# EAGLE design XMICRO-BREAKOUT V1.0 (EAGLE 6.3)
PROJECT_NAME: XMICRO-BREAKOUT; PROJECT_REVISION: 1.0
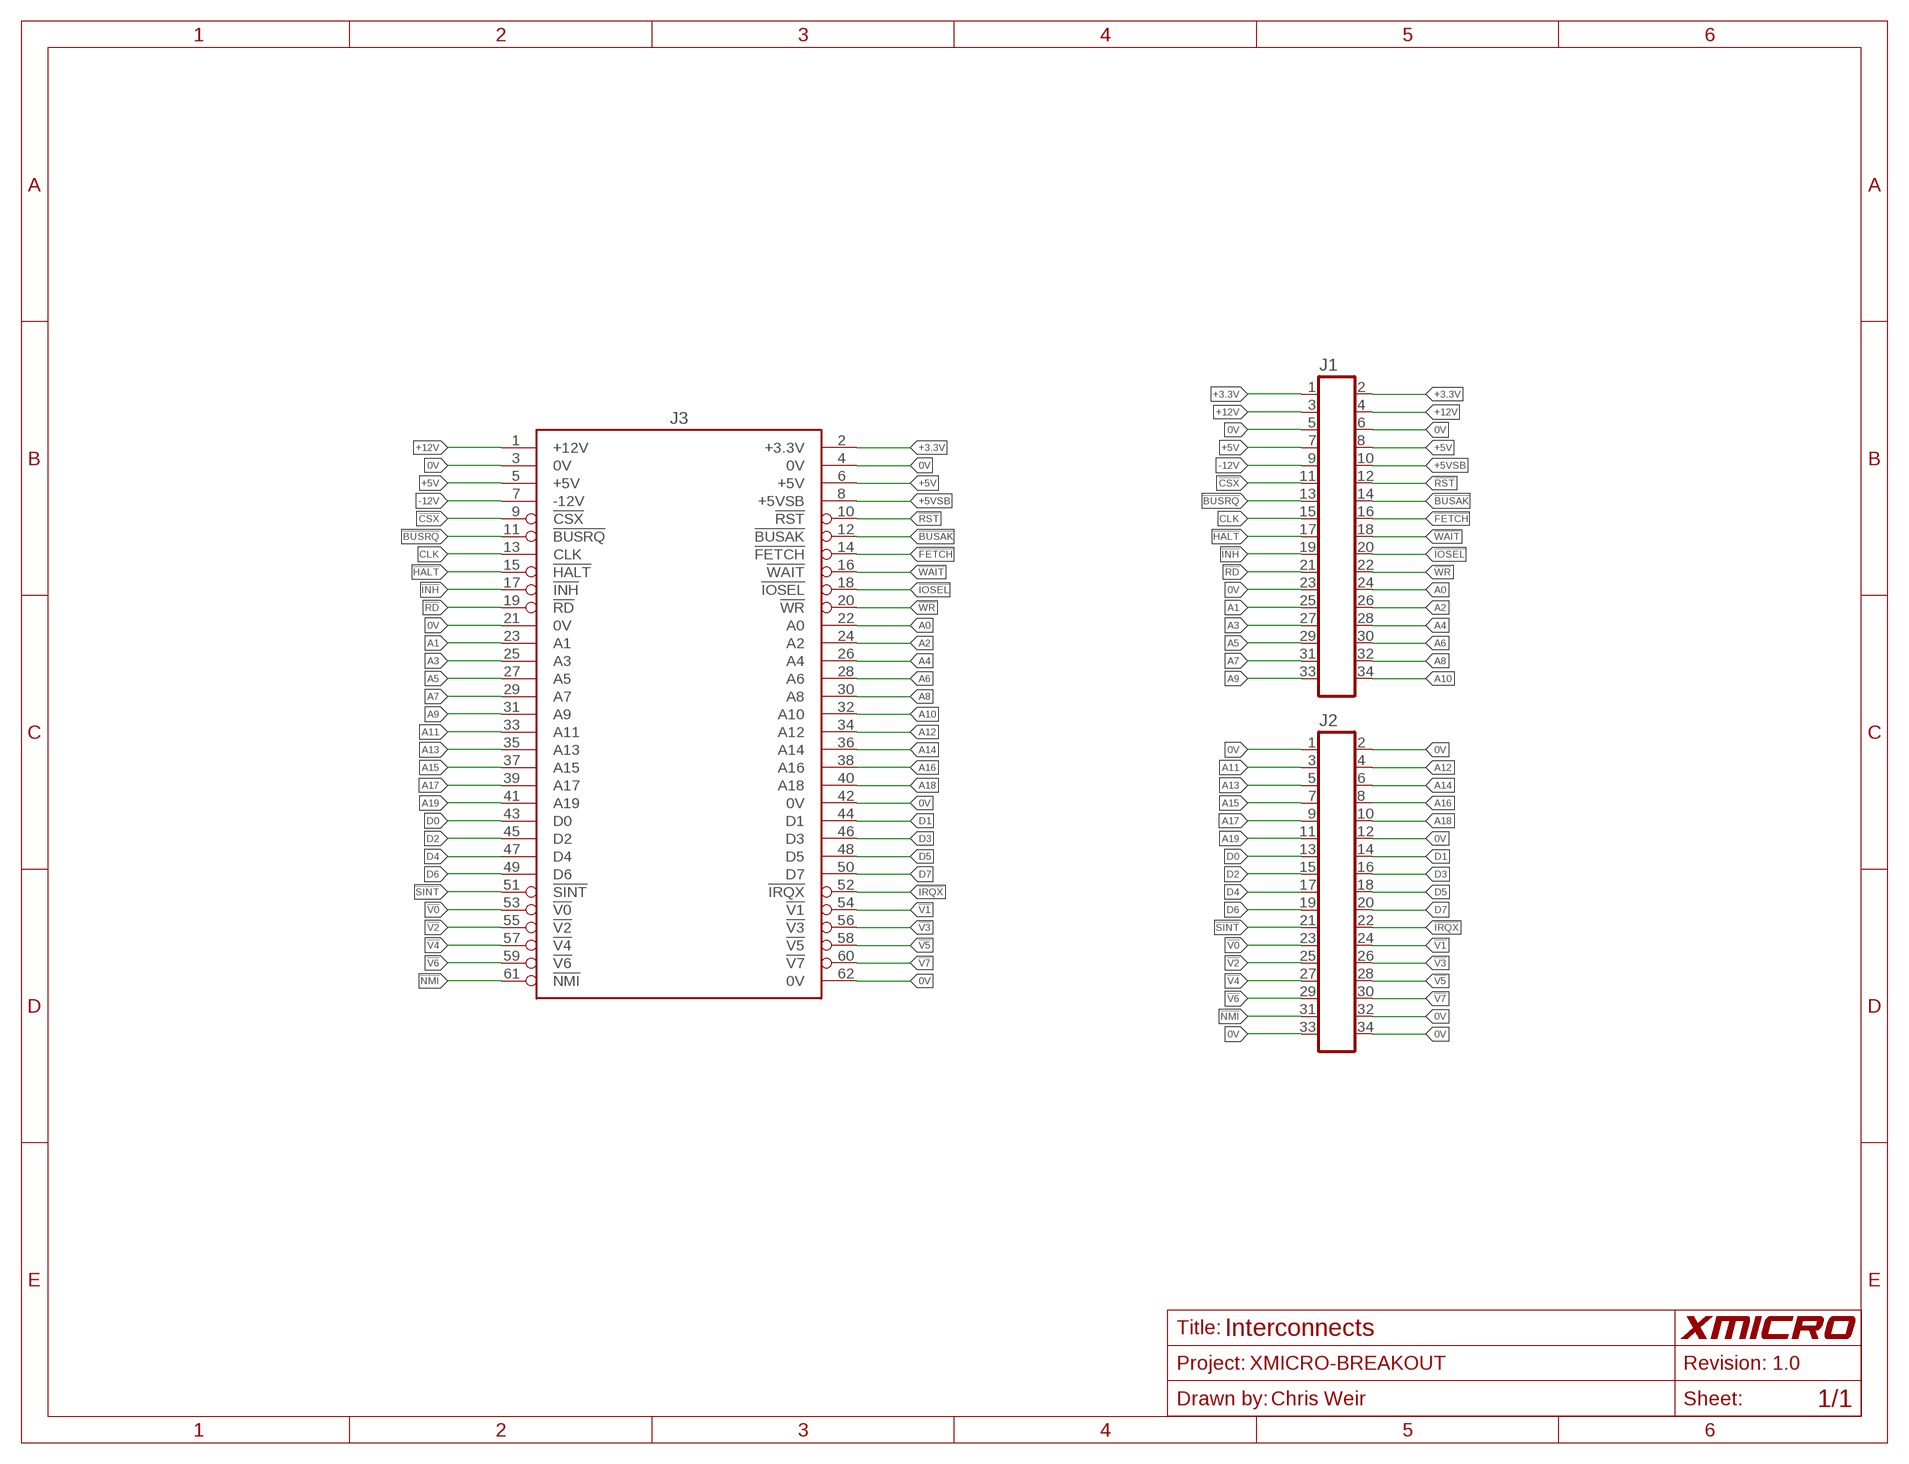
[diagram p0: schematic, sheet 1]
FRAME1 (LETTER): DRAWN_BY: Chris Weir; SHEET_TITLE: Interconnects

## Parts
J1  HDR-17X2  [HDR-17X2S]
J2  HDR-17X2  [HDR-17X2S]
J3  XMICRO-BUS-PHYSICAL-M  [EDGE62M]

## Nets
0V [SUPPLY]: J1.5 J1.6 J1.23 J2.1 J2.2 J2.12 J2.32 J2.33 J2.34 J3.3(0V) J3.4(0V) J3.21(0V) J3.42(0V) J3.62(0V)
!BUSAK: J1.14 J3.12(!BUSAK)
!BUSRQ: J1.13 J3.11(!BUSRQ)
!CSX: J1.11 J3.9(!CSX)
!FETCH: J1.16 J3.14(!FETCH)
!HALT: J1.17 J3.15(!HALT)
!INH: J1.19 J3.17(!INH)
!IOSEL: J1.20 J3.18(!IOSEL)
!IRQX: J2.22 J3.52(!IRQX)
!NMI: J2.31 J3.61(!NMI)
!RD: J1.21 J3.19(!RD)
!RST: J1.12 J3.10(!RST)
!SINT: J2.21 J3.51(!SINT)
!V0: J2.23 J3.53(!V0)
!V1: J2.24 J3.54(!V1)
!V2: J2.25 J3.55(!V2)
!V3: J2.26 J3.56(!V3)
!V4: J2.27 J3.57(!V4)
!V5: J2.28 J3.58(!V5)
!V6: J2.29 J3.59(!V6)
!V7: J2.30 J3.60(!V7)
!WAIT: J1.18 J3.16(!WAIT)
!WR: J1.22 J3.20(!WR)
+3.3V [SUPPLY]: J1.1 J1.2 J3.2(+3.3V)
+5V [SUPPLY]: J1.7 J1.8 J3.5(+5V) J3.6(+5V)
+5VSB [SUPPLY]: J1.10 J3.8(+5VSB)
+12V [SUPPLY]: J1.3 J1.4 J3.1(+12V)
-12V [SUPPLY]: J1.9 J3.7(-12V)
A0: J1.24 J3.22(A0)
A1: J1.25 J3.23(A1)
A2: J1.26 J3.24(A2)
A3: J1.27 J3.25(A3)
A4: J1.28 J3.26(A4)
A5: J1.29 J3.27(A5)
A6: J1.30 J3.28(A6)
A7: J1.31 J3.29(A7)
A8: J1.32 J3.30(A8)
A9: J1.33 J3.31(A9)
A10: J1.34 J3.32(A10)
A11: J2.3 J3.33(A11)
A12: J2.4 J3.34(A12)
A13: J2.5 J3.35(A13)
A14: J2.6 J3.36(A14)
A15: J2.7 J3.37(A15)
A16: J2.8 J3.38(A16)
A17: J2.9 J3.39(A17)
A18: J2.10 J3.40(A18)
A19: J2.11 J3.41(A19)
CLK: J1.15 J3.13(CLK)
D0: J2.13 J3.43(D0)
D1: J2.14 J3.44(D1)
D2: J2.15 J3.45(D2)
D3: J2.16 J3.46(D3)
D4: J2.17 J3.47(D4)
D5: J2.18 J3.48(D5)
D6: J2.19 J3.49(D6)
D7: J2.20 J3.50(D7)

## Library data of the parts
J1 J2 = connector-misc:HDR-17X2
J3 = xmicro:XMICRO-BUS-PHYSICAL: XMICRO Bus Symbol with physical pin arrangement

## Net classes
1 SUPPLY: width 0.254 mm, clearance 0.305 mm
2 CHASSIS: clearance 0.762 mm

## Board
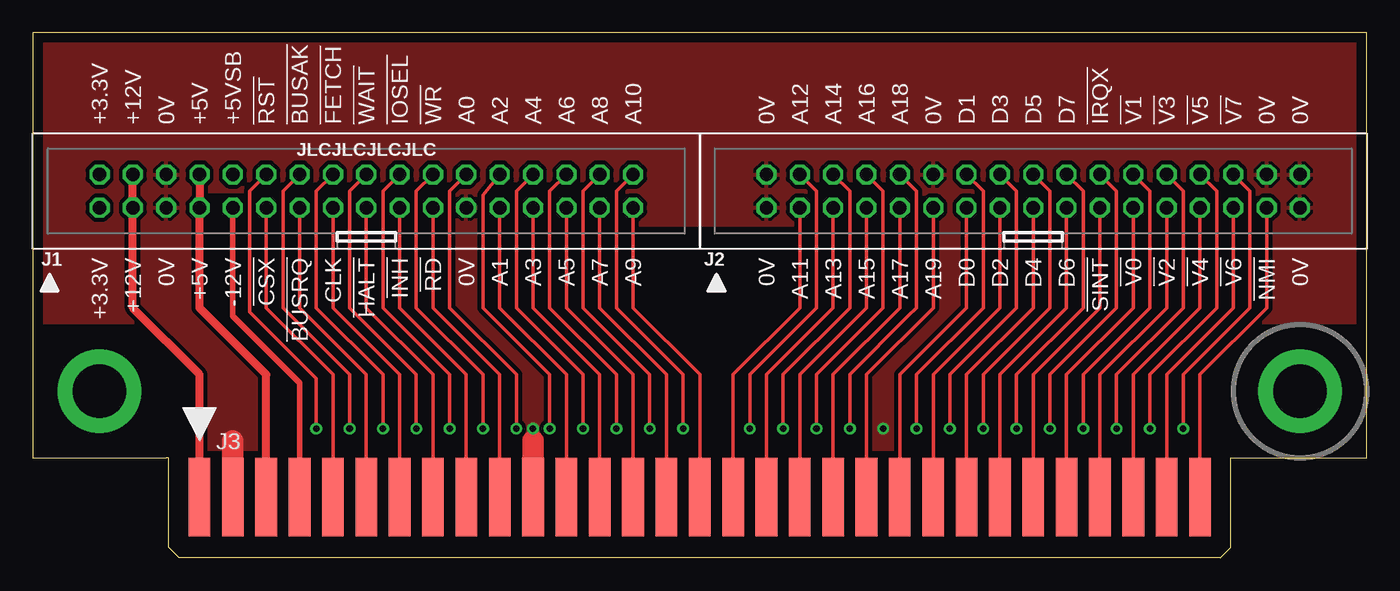
[diagram p1: board, top side]
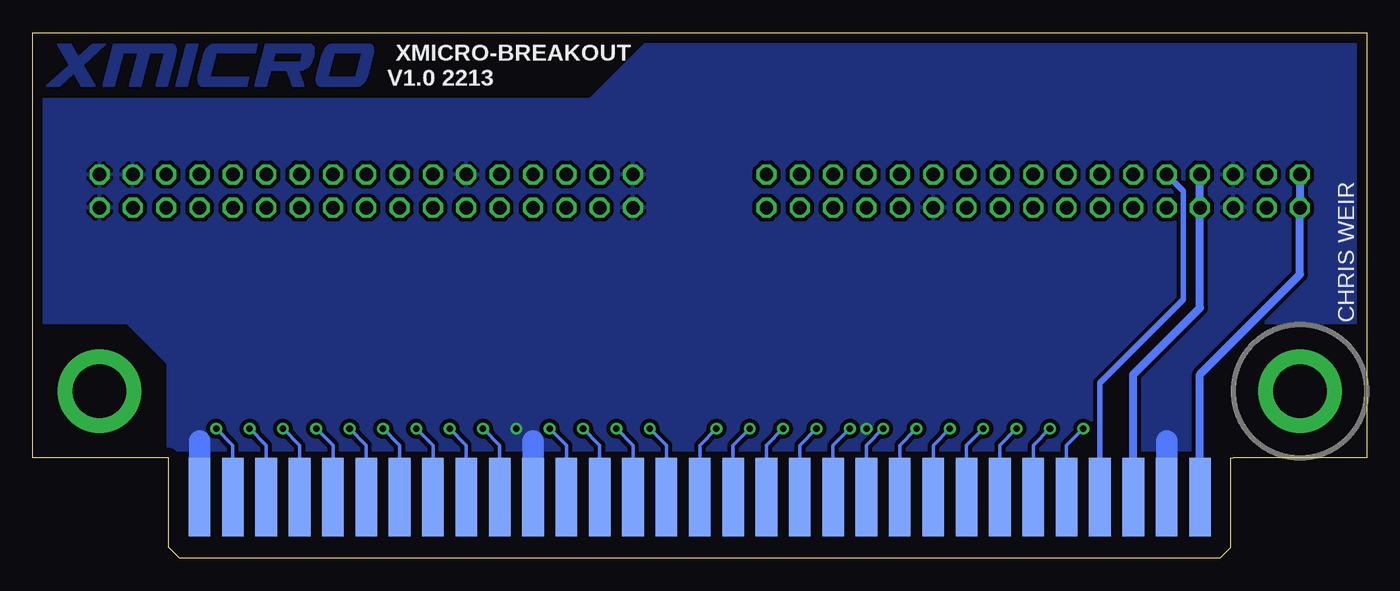
[diagram p2: board, bottom side, seen from below]

Size 101.6 x 40.01 mm. Coordinates in mm from the lower left corner, seen from the top.
Outline: 10.16,7.62 0,7.62 0,40.01 101.6,40.01 101.6,7.62 91.44,7.62
Copper layers (1*16): Top 0.035mm / dielectric 1.5mm / Bottom 0.035mm
Design rules "JLCPCB Standard": minimum track width 5mil, minimum drill 0.3mm, track to track 5mil, track to pad 8mil, pad to pad 8mil, via to via 8mil, smd to smd 5mil, copper to edge 30mil, drill to drill 0.26mm, minimum pad ring 10mil, minimum via ring 8mil, stop-mask expansion 3mil, vias tented up to drill 25mil, thermal gap 10mil
tRestrict: area 91.4,7.6 to 101.6,17.8; area 0,7.6 to 10.2,17.8; 4 lines
bRestrict: area 91.4,7.6 to 101.6,17.8; area 0,7.6 to 10.2,17.8; 4 lines

### Footprints (pad centres in the part's own frame; a part is rotated, then mirrored left to right if it is on the bottom)
HDR-17X2S = drill 1.016 octagon: 1 -20.32,-1.27; 2 -20.32,1.27; 3 -17.78,-1.27; 4 -17.78,1.27; 5 -15.24,-1.27; 6 -15.24,1.27; 7 -12.7,-1.27; 8 -12.7,1.27; 9 -10.16,-1.27; 10 -10.16,1.27; 11 -7.62,-1.27; 12 -7.62,1.27; 13 -5.08,-1.27; 14 -5.08,1.27; 15 -2.54,-1.27; 16 -2.54,1.27; 17 0,-1.27; 18 0,1.27; 19 2.54,-1.27; 20 2.54,1.27; 21 5.08,-1.27; 22 5.08,1.27; 23 7.62,-1.27; 24 7.62,1.27; 25 10.16,-1.27; 26 10.16,1.27; 27 12.7,-1.27; 28 12.7,1.27; 29 15.24,-1.27; 30 15.24,1.27; 31 17.78,-1.27; 32 17.78,1.27; 33 20.32,-1.27; 34 20.32,1.27
EDGE62M = smd 1.651 x 5.969: 1 -38.1,-3.01; 3 -35.56,-3.01; 5 -33.02,-3.01; 7 -30.48,-3.01; 9 -27.94,-3.01; 11 -25.4,-3.01; 13 -22.86,-3.01; 15 -20.32,-3.01; 17 -17.78,-3.01; 19 -15.24,-3.01; 21 -12.7,-3.01; 23 -10.16,-3.01; 25 -7.62,-3.01; 27 -5.08,-3.01; 29 -2.54,-3.01; 31 0,-3.01; 33 2.54,-3.01; 35 5.08,-3.01; 37 7.62,-3.01; 39 10.16,-3.01; 41 12.7,-3.01; 43 15.24,-3.01; 45 17.78,-3.01; 47 20.32,-3.01; 49 22.86,-3.01; 51 25.4,-3.01; 53 27.94,-3.01; 55 30.48,-3.01; 57 33.02,-3.01; 59 35.56,-3.01; 61 38.1,-3.01 | smd 1.651 x 5.969 bottom: 2 -38.1,-3.01; 4 -35.56,-3.01; 6 -33.02,-3.01; 8 -30.48,-3.01; 10 -27.94,-3.01; 12 -25.4,-3.01; 14 -22.86,-3.01; 16 -20.32,-3.01; 18 -17.78,-3.01; 20 -15.24,-3.01; 22 -12.7,-3.01; 24 -10.16,-3.01; 26 -7.62,-3.01; 28 -5.08,-3.01; 30 -2.54,-3.01; 32 0,-3.01; 34 2.54,-3.01; 36 5.08,-3.01; 38 7.62,-3.01; 40 10.16,-3.01; 42 12.7,-3.01; 44 15.24,-3.01; 46 17.78,-3.01; 48 20.32,-3.01; 50 22.86,-3.01; 52 25.4,-3.01; 54 27.94,-3.01; 56 30.48,-3.01; 58 33.02,-3.01; 60 35.56,-3.01; 62 38.1,-3.01

### Placement (x,y rotation side)
J1  25.4,27.94 0 top
J2  76.2,27.94 0 top
J3  50.8,7.62 0 top

### Tracks (layer width: path | path; a pad name or v marks a point on that pad's centre or on a via)
0V  (via drill 0.5)
  Top 1.651: J3.21 38.1,8.89 | J3.3 15.24,8.89
  Bottom 1.651: J3.62 88.9,8.89 | J3.42 63.5,8.89 | J3.3 15.24,8.89
  other vias: 38.1,9.84 64.77,9.84
  pour Top (rank 2): 0,40.01 101.6,40.01 101.6,7.62 91.44,7.62 91.44,8.26 10.16,8.26 10.16,7.62 0,7.62
  pour Bottom (rank 2): 0,40.01 101.6,40.01 101.6,7.62 91.44,7.62 91.44,8.26 10.16,8.26 10.16,7.62 0,7.62
!BUSAK  (via drill 0.5)
  Top 0.254: v24.13,9.84 24.13,13.97 19.05,19.05 19.05,27.94 J1.14
  Bottom 0.254: J3.12 25.4,8.57 v24.13,9.84
!BUSRQ
  Top 0.254: J3.11 25.4,13.97 20.32,19.05 J1.13
!CSX
  Top 0.254: J3.9 22.86,13.97 17.78,19.05 J1.11
!FETCH  (via drill 0.5)
  Top 0.254: v26.67,9.84 26.67,13.97 21.59,19.05 21.59,27.94 J1.16
  Bottom 0.254: J3.14 27.94,8.57 v26.67,9.84
!HALT
  Top 0.254: J3.15 30.48,13.97 25.4,19.05 J1.17
!INH
  Top 0.254: J3.17 33.02,13.97 27.94,19.05 J1.19
!IOSEL  (via drill 0.5)
  Top 0.254: v31.75,9.84 31.75,13.97 26.67,19.05 26.67,27.94 J1.20
  Bottom 0.254: J3.18 33.02,8.57 v31.75,9.84
!IRQX  (via drill 0.5)
  Top 0.254: v77.47,9.84 77.47,13.97 82.55,19.05 82.55,27.94 J2.22
  Bottom 0.254: J3.52 76.2,8.57 v77.47,9.84
!NMI
  Top 0.254: J3.61 88.9,13.97 93.98,19.05 J2.31
!RD
  Top 0.254: J3.19 35.56,13.97 30.48,19.05 J1.21
!RST  (via drill 0.5)
  Top 0.254: v21.59,9.84 21.59,13.65 16.51,18.73 16.51,27.94 J1.12
  Bottom 0.254: J3.10 22.86,8.57 v21.59,9.84
!SINT
  Top 0.254: J3.51 76.2,13.97 81.28,19.05 J2.21
!V0
  Top 0.254: J3.53 78.74,13.97 83.82,19.05 J2.23
!V1  (via drill 0.5)
  Top 0.254: v80.01,9.84 80.01,13.97 85.09,19.05 85.09,27.94 J2.24
  Bottom 0.254: J3.54 78.74,8.57 v80.01,9.84
!V2
  Top 0.254: J3.55 81.28,13.97 86.36,19.05 J2.25
!V3  (via drill 0.5)
  Top 0.254: v82.55,9.84 82.55,13.97 87.63,19.05 87.63,27.94 J2.26
  Bottom 0.254: J3.56 81.28,8.57 v82.55,9.84
!V4
  Top 0.254: J3.57 83.82,13.97 88.9,19.05 J2.27
!V5  (via drill 0.5)
  Top 0.254: v85.09,9.84 85.09,13.97 90.17,19.05 90.17,27.94 J2.28
  Bottom 0.254: J3.58 83.82,8.57 v85.09,9.84
!V6
  Top 0.254: J3.59 86.36,13.97 91.44,19.05 J2.29
!V7  (via drill 0.5)
  Top 0.254: v87.63,9.84 87.63,13.97 92.71,19.05 92.71,27.94 J2.30
  Bottom 0.254: J3.60 86.36,8.57 v87.63,9.84
!WAIT  (via drill 0.5)
  Top 0.254: v29.21,9.84 29.21,13.97 24.13,19.05 24.13,27.94 J1.18
  Bottom 0.254: J3.16 30.48,8.57 v29.21,9.84
!WR  (via drill 0.5)
  Top 0.254: v34.29,9.84 34.29,13.97 29.21,19.05 29.21,27.94 J1.22
  Bottom 0.254: J3.20 35.56,8.57 v34.29,9.84
+3.3V
  Bottom 0.61: J3.2 12.7,13.97 5.08,21.59 J1.1 J1.2
+5V
  Top 0.61: J3.5 17.78,13.97 12.7,19.05 J1.7 J1.8
  Bottom 0.61: J3.5 17.78,13.97 12.7,19.05 J1.7 J1.8
+5VSB
  Bottom 0.406: J3.8 20.32,13.34 13.97,19.68 13.97,27.94 J1.10
+12V
  Top 0.61: J3.1 12.7,13.97 7.62,19.05 J1.3 J1.4
-12V
  Top 0.406: J3.7 20.32,13.34 15.24,18.41 J1.9
A0  (via drill 0.5)
  Top 0.254: v36.83,9.84 36.83,13.97 31.75,19.05 31.75,27.94 J1.24
  Bottom 0.254: J3.22 38.1,8.57 v36.83,9.84
A1
  Top 0.254: J3.23 40.64,13.97 35.56,19.05 J1.25
A2  (via drill 0.5)
  Top 0.254: v39.37,9.84 39.37,13.97 34.29,19.05 34.29,27.62 J1.26
  Bottom 0.254: J3.24 40.64,8.57 v39.37,9.84
A3
  Top 0.254: J3.25 43.18,13.97 38.1,19.05 J1.27
A4  (via drill 0.5)
  Top 0.254: v41.91,9.84 41.91,13.97 36.83,19.05 36.83,27.94 J1.28
  Bottom 0.254: J3.26 43.18,8.57 v41.91,9.84
A5
  Top 0.254: J3.27 45.72,13.97 40.64,19.05 J1.29
A6  (via drill 0.5)
  Top 0.254: v44.45,9.84 44.45,13.97 39.37,19.05 39.37,27.94 J1.30
  Bottom 0.254: J3.28 45.72,8.57 v44.45,9.84
A7
  Top 0.254: J3.29 48.26,13.97 43.18,19.05 J1.31
A8  (via drill 0.5)
  Top 0.254: v46.99,9.84 46.99,13.97 41.91,19.05 41.91,27.94 J1.32
  Bottom 0.254: J3.30 48.26,8.57 v46.99,9.84
A9
  Top 0.254: J3.31 50.8,13.97 45.72,19.05 J1.33
A10  (via drill 0.5)
  Top 0.254: v49.53,9.84 49.53,13.97 44.45,19.05 44.45,27.94 J1.34
  Bottom 0.254: J3.32 50.8,8.57 v49.53,9.84
A11
  Top 0.254: J3.33 53.34,13.97 58.42,19.05 J2.3
A12  (via drill 0.5)
  Top 0.254: v54.61,9.84 54.61,13.97 59.69,19.05 59.69,27.94 J2.4
  Bottom 0.254: J3.34 53.34,8.57 v54.61,9.84
A13
  Top 0.254: J2.5 60.96,19.05 55.88,13.97 J3.35
A14  (via drill 0.5)
  Top 0.254: v57.15,9.84 57.15,13.97 62.23,19.05 62.23,27.94 J2.6
  Bottom 0.254: J3.36 55.88,8.57 v57.15,9.84
A15
  Top 0.254: J3.37 58.42,13.97 63.5,19.05 J2.7
A16  (via drill 0.5)
  Top 0.254: v59.69,9.84 59.69,13.97 64.77,19.05 64.77,27.94 J2.8
  Bottom 0.254: J3.38 58.42,8.57 v59.69,9.84
A17
  Top 0.254: J3.39 60.96,13.97 66.04,19.05 J2.9
A18  (via drill 0.5)
  Top 0.254: v62.23,9.84 62.23,13.97 66.67,18.41 67.31,19.05 67.31,27.94 J2.10
  Bottom 0.254: J3.40 60.96,8.57 v62.23,9.84
A19
  Top 0.254: J3.41 63.5,13.97 68.58,19.05 J2.11
CGND3  (via drill 4.06 pad 6.35)
  other vias: 96.52,12.7
CGND4  (via drill 4.06 pad 6.35)
  other vias: 5.08,12.7
CLK
  Top 0.254: J3.13 27.94,13.97 22.86,19.05 J1.15
D0
  Top 0.254: J3.43 66.04,13.97 71.12,19.05 J2.13
D1  (via drill 0.5)
  Top 0.254: v67.31,9.84 67.31,13.97 72.39,19.05 72.39,27.94 J2.14
  Bottom 0.254: J3.44 66.04,8.57 v67.31,9.84
D2
  Top 0.254: J3.45 68.58,13.97 73.66,19.05 J2.15
D3  (via drill 0.5)
  Top 0.254: v69.85,9.84 69.85,13.97 74.93,19.05 74.93,27.94 J2.16
  Bottom 0.254: J3.46 68.58,8.57 v69.85,9.84
D4
  Top 0.254: J3.47 71.12,13.97 76.2,19.05 J2.17
D5  (via drill 0.5)
  Top 0.254: v72.39,9.84 72.39,13.97 77.47,19.05 77.47,27.94 J2.18
  Bottom 0.254: J3.48 71.12,8.57 v72.39,9.84
D6
  Top 0.254: J3.49 73.66,13.97 78.74,19.05 J2.19
D7  (via drill 0.5)
  Top 0.254: v74.93,9.84 74.93,13.97 80.01,19.05 80.01,27.94 J2.20
  Bottom 0.254: J3.50 73.66,8.57 v74.93,9.84
LOGO-C1
  pour Bottom (no thermals): 84.49,39.18 84.66,38.49 87.65,38.49 88.13,36.61 85.16,36.61 85.32,35.92 88.61,35.92 arc47 88.88,36.04 arc36 89.02,36.35 arc17 89.01,36.62 arc5 88.98,36.77 88.58,38.34 arc33 88.21,38.95 arc31 87.84,39.17 arc13 87.7,39.18
LOGO-I1
  pour Bottom (no thermals): 89.88,39.18 89,39.18 89.84,35.92 90.72,35.92
LOGO-M1
  pour Bottom (no thermals): 96.28,35.92 95.44,39.18 91.15,39.18 arc50 90.82,39.05 arc37 90.69,38.76 arc17 90.72,38.38 91.36,35.92 92.24,35.92 91.56,38.49 92.7,38.49 93.37,35.92 94.26,35.92 93.58,38.49 94.73,38.49 95.39,35.92
LOGO-O1
  pour Bottom (no thermals): 78.61,38.49 76.52,38.49 77.02,36.61 79.14,36.61 78.64,38.49 78.59,39.18 78.7,39.18 arc-33 79.09,39.04 arc-19 79.37,38.73 arc-18 79.55,38.34 79.98,36.75 arc-9 80,36.65 arc-9 80.01,36.41 arc-22 79.96,36.19 arc-36 79.84,36.01 arc-17 79.71,35.94 arc-13 79.57,35.92 76.99,35.92 arc-18 76.79,35.95 arc-16 76.6,36.05 arc-14 76.37,36.26 arc-26 76.11,36.73 75.67,38.4 arc-17 75.65,38.68 arc-19 75.7,38.91 arc-66 76.08,39.18 78.56,39.18
LOGO-R1
  pour Bottom (no thermals): 83.85,39.18 83.15,38.49 83.32,37.78 81.21,37.78 81.04,38.49 83.12,38.49 83.82,39.18 80.69,39.18 arc55 80.27,38.97 arc31 80.16,38.72 arc18 80.19,38.39 80.3,37.98 arc18 80.38,37.79 arc18 80.69,37.39 arc19 81,37.19 arc14 81.35,37.13 80.92,35.92 81.8,35.92 82.23,37.14 83.5,37.14 83.82,35.92 84.7,35.92
LOGO-X1
  pour Bottom (no thermals): 100.57,35.92 99.58,35.92 98.47,36.96 97.91,35.92 96.86,35.92 97.81,37.55 96.03,39.18 97.02,39.18 98.14,38.15 98.7,39.18 99.74,39.18 98.8,37.53

### Text on the board
tPlace: JLCJLCJLCJLC
bPlace: CHRIS WEIR
tNames: +3.3V | +12V | 0V | +5V | +5VSB | !RST | !BUSAK | !FETCH | !WAIT | !IOSEL | !WR | A0 | A2 | A4 | A6 | A8 | A10 | 0V | A12 | A14 | A16 | A18 | 0V | D1 | D3 | D5 | D7 | !IRQX | !V1 | !V3 | !V5 | !V7 | 0V | 0V | +3.3V | +12V | 0V | +5V | -12V | !CSX | !BUSRQ | CLK | !HALT | !INH | !RD | 0V | A1 | A3 | A5 | A7 | A9 | 0V | A11 | A13 | A15 | A17 | A19 | D0 | D2 | D4 | D6 | !SINT | !V0 | !V2 | !V4 | !V6 | !NMI | 0V
bNames: XMICRO-BREAKOUT | V1.0 2213